# Altium schematic sheet Motor Interface - Connectors.SchDoc: Motor Interface - Connectors
size B; Organization: Midnight Sun Solar Rayce Car Team; Address1: University of Waterloo; Address2: 200 University Ave W; Address3: Waterloo, ON, Canada; Address4: N2L 3E9; DocumentNumber: 2; SheetNumber: 2; SheetTotal: 6; Website: www.uwmidsun.com
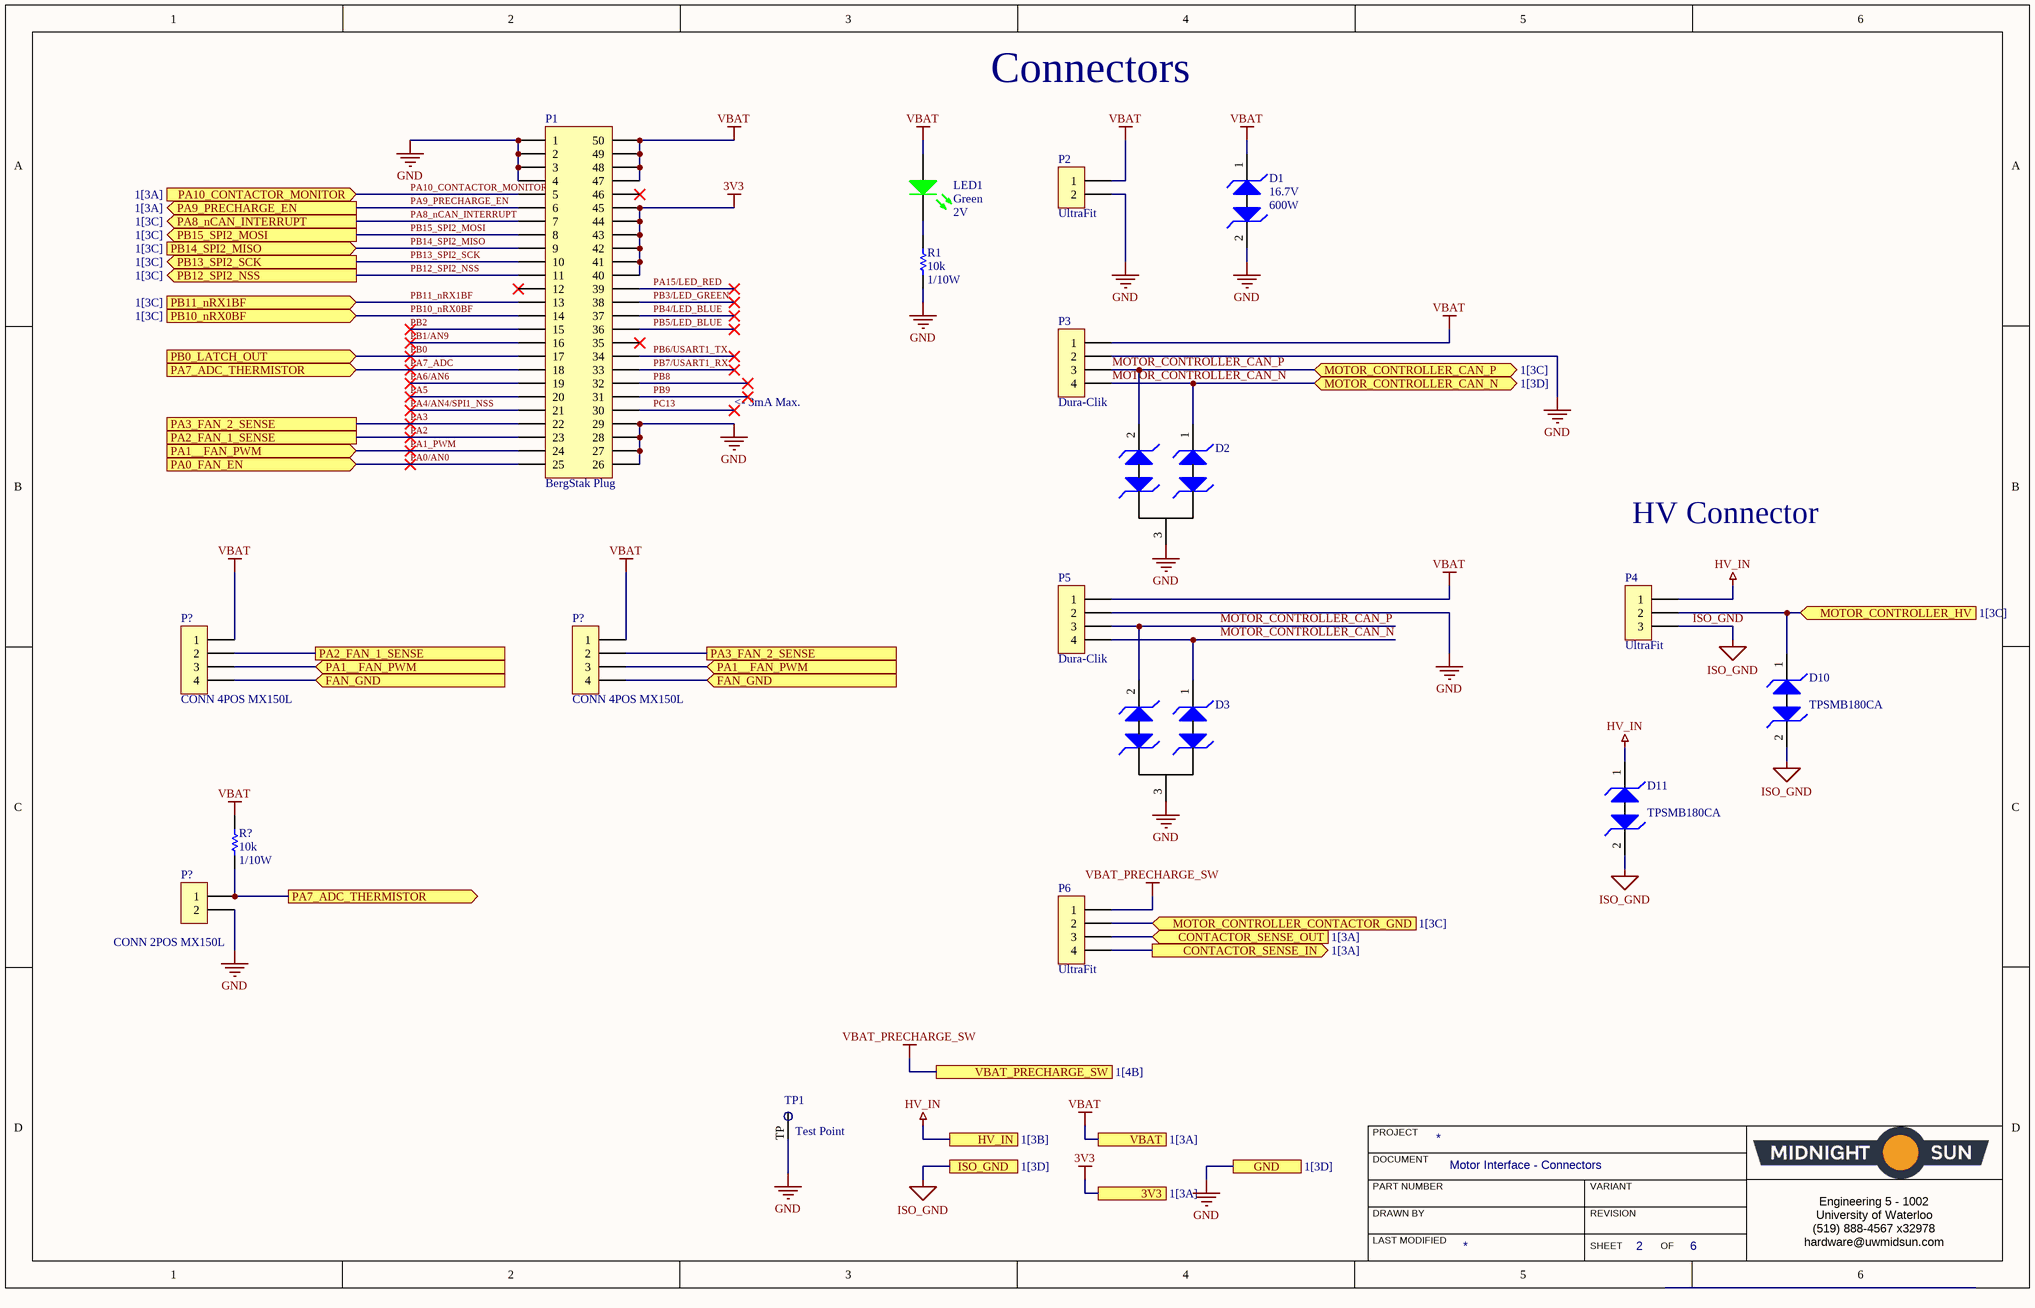
[diagram p0: Motor Interface - Connectors.SchDoc]

## Parts
(Parts that share a designator on the sheet are numbered #1, #2 ... from top to bottom, then left to right.)
D1  Voltage - Breakdown (Min): 16.7V  Power - Peak Pulse: 600W  [DO-214AA Diode]  (hidden comment: DIODE TVS 15VWM 24.4VC DO-214AA (SMB))
D2  DIODE TVS 24VWM 70VC SOT23  [MOSFET P-CH 30V 3.8A SOT-23]  (value not drawn)
D3  DIODE TVS 24VWM 70VC SOT23  [MOSFET P-CH 30V 3.8A SOT-23]  (value not drawn)
D10  Manufacturer Part Number: TPSMB180CA  [DIODE TVS TPSMB 600W DO-214AA SMB]  (hidden comment: TVS DIODE 154V 246V DO214AA)
D11  Manufacturer Part Number: TPSMB180CA  [DIODE TVS TPSMB 600W DO-214AA SMB]  (hidden comment: TVS DIODE 154V 246V DO214AA)
LED1  Color: Green  Voltage - Forward (Vf) (Typ): 2V  [LED_0603]  (hidden comment: LED GREEN CLEAR 2V 0603)
P1  Series: BergStak Plug  [CONN, Bergstak 50 Pos Plug]  (hidden comment: CONN 50POS Bergstak Plug 0.02")
P2  Series: UltraFit  [CONN, 2POS ULTRA-FIT]  (hidden comment: CONN 2POS ULTRA-FIT 0.138")
P3  Dura-Clik  [CONN, 4POS DURA-CLIK VERT]
P4  Series: UltraFit  [CONN, 3POS ULTRA-FIT]  (hidden comment: CONN 3POS ULTRA-FIT 0.138")
P5  Dura-Clik  [CONN, 4POS DURA-CLIK VERT]
P6  Series: UltraFit  [CONN, 4POS ULTRA-FIT]  (hidden comment: CONN 4POS ULTRA-FIT 0.138")
P?#1  CONN 4POS MX150L  [CONN, 4POS MX150L]
P?#2  CONN 4POS MX150L  [CONN, 4POS MX150L]
P?#3  CONN 2POS MX150L  [CONN, 2POS MX150L]
R1  Resistance: 10k  Power: 1/10W  [RES, 0603]  (hidden comment: RES 10K OHM 1% 1/10W 0603)
R?  Resistance: 10k  Power: 1/10W  [RES, 0603]  (hidden comment: RES 10K OHM 1% 1/10W 0603)
TP1  Test Point  [Test Point]

## Ports
3V3 (see 1[3A]), CONTACTOR_SENSE_IN (out, see 1[3A]), CONTACTOR_SENSE_OUT (in, see 1[3A]), FAN_GND (in), GND (see 1[3D]), HV_IN (see 1[3B]), ISO_GND (see 1[3D]), MOTOR_CONTROLLER_CAN_N (bidir, see 1[3D]), MOTOR_CONTROLLER_CAN_P (bidir, see 1[3C]), MOTOR_CONTROLLER_CONTACTOR_GND (in, see 1[3C]), MOTOR_CONTROLLER_HV (in, see 1[3C]), PA0_FAN_EN (in), PA1__FAN_PWM (in), PA2_FAN_1_SENSE, PA3_FAN_2_SENSE, PA7_ADC_THERMISTOR (in), PA7_ADC_THERMISTOR (out), PA8_nCAN_INTERRUPT (out, see 1[3C]), PA9_PRECHARGE_EN (out, see 1[3A]), PA10_CONTACTOR_MONITOR (in, see 1[3A]), PB0_LATCH_OUT (in), PB10_nRX0BF (in, see 1[3C]), PB11_nRX1BF (in, see 1[3C]), PB12_SPI2_NSS (out, see 1[3C]), PB13_SPI2_SCK (out, see 1[3C]), PB14_SPI2_MISO (in, see 1[3C]), PB15_SPI2_MOSI (out, see 1[3C]), VBAT (see 1[3A]), VBAT_PRECHARGE_SW (see 1[4B])

## Nets
3V3: P1.40 P1.41 P1.42 P1.43 P1.44 P1.45 ; port 3V3
GND: D1.2(Cathode2) D2.3(Common_Cathode) D3.3(Common_Cathode) P1.1 P1.2 P1.3 P1.4 P1.26 P1.27 P1.28 P1.29 P2.2 P3.2 P5.2 P?#3.2 R1.2 TP1.TP ; port GND
HV_IN: D11.1(Cathode1) P4.1 ; port HV_IN
ISO_GND: D10.2(Cathode2) D11.2(Cathode2) P4.3 ; port ISO_GND
VBAT: D1.1(Cathode1) LED1.1(A) P1.47 P1.48 P1.49 P1.50 P2.1 P3.1 P5.1 P?#1.1 P?#2.1 R?.1 ; port VBAT
VBAT_PRECHARGE_SW: P6.1 ; port VBAT_PRECHARGE_SW
CONTACTOR_SENSE_IN: P6.4 ; port CONTACTOR_SENSE_IN
CONTACTOR_SENSE_OUT: P6.3 ; port CONTACTOR_SENSE_OUT
FAN_GND: P?#1.4 P?#2.4 ; port FAN_GND
MOTOR_CONTROLLER_CAN_N: D2.1(Cathode1) D3.1(Cathode1) P3.4 P5.4 ; port MOTOR_CONTROLLER_CAN_N
MOTOR_CONTROLLER_CAN_P: D2.2(Cathode2) D3.2(Cathode2) P3.3 P5.3 ; port MOTOR_CONTROLLER_CAN_P
MOTOR_CONTROLLER_CONTACTOR_GND: P6.2 ; port MOTOR_CONTROLLER_CONTACTOR_GND
MOTOR_CONTROLLER_HV: D10.1(Cathode1) P4.2 ; port MOTOR_CONTROLLER_HV
PA0/AN0: P1.25 ; port PA0_FAN_EN
PA1_PWM: P1.24 P?#1.3 P?#2.3 ; port PA1__FAN_PWM
PA2: P1.23 P?#1.2 ; port PA2_FAN_1_SENSE
PA3: P1.22 P?#2.2 ; port PA3_FAN_2_SENSE
PA4/AN4/SPI1_NSS: P1.21
PA5: P1.20
PA6/AN6: P1.19
PA7_ADC: P1.18 P?#3.1 R?.2 ; port PA7_ADC_THERMISTOR
PA8_nCAN_INTERRUPT: P1.7 ; port PA8_nCAN_INTERRUPT
PA9_PRECHARGE_EN: P1.6 ; port PA9_PRECHARGE_EN
PA10_CONTACTOR_MONITOR: P1.5 ; port PA10_CONTACTOR_MONITOR
PA15/LED_RED: P1.39
PB0: P1.17 ; port PB0_LATCH_OUT
PB1/AN9: P1.16
PB2: P1.15
PB3/LED_GREEN: P1.38
PB4/LED_BLUE: P1.37
PB5/LED_BLUE: P1.36
PB6/USART1_TX: P1.34
PB7/USART1_RX: P1.33
PB8: P1.32
PB9: P1.31
PB10_nRX0BF: P1.14 ; port PB10_nRX0BF
PB11_nRX1BF: P1.13 ; port PB11_nRX1BF
PB12_SPI2_NSS: P1.11 ; port PB12_SPI2_NSS
PB13_SPI2_SCK: P1.10 ; port PB13_SPI2_SCK
PB14_SPI2_MISO: P1.9 ; port PB14_SPI2_MISO
PB15_SPI2_MOSI: P1.8 ; port PB15_SPI2_MOSI
PC13: P1.30
NetLED1_2: LED1.2(K) R1.1

Not connected (* = marked no-connect by the designer): P1 12* 35* 46*

## Notes on the sheet
- Connectors
- <- 3mA Max.
- HV Connector
- PROJECT
- DOCUMENT
- DRAWN BY
- LAST MODIFIED
- PART NUMBER
- REVISION
- SHEET
- VARIANT
- OF
- Engineering 5 - 1002
  University of Waterloo
  (519) 888-4567 x32978
  hardware@uwmidsun.com

## Library data of the parts
D1 = DIODE TVS 15VWM 24.4VC DO-214AA (SMB): TVS DIODE 15VWM 24.4VC SMB; Manufacturer 1: Fairchild/ON Semiconductor; Manufacturer Part Number 1: SMBJ15CA; Type: Zener; Voltage - Reverse Standoff (Typ): 15V; Voltage - Clamping (Max) @ Ipp: 24.4V; Current - Peak Pulse (10/1000µs): 24.6A; Power Line Protection: No; Supplier 1: Digi-Key; Supplier Part Number 1: SMBJ15CAFSCT-ND; RoHS: RoHS Compliant; Description 1: TVS DIODE 15VWM 24.4VC SMB; Category: Circuit Protection; Stock 1: 24965; Pricing 1: 1=0.54, 10=0.444, 100=0.3027, 500=0.22704, 1000=0.17028 (CAD); Packaging: Cut Tape (CT); Part Status: Active; Applications: General Purpose; Capacitance @ Frequency: -; Operating Temperature: -55°C ~ 150°C (TJ); Mounting Type: Surface Mount; Package / Case: DO-214AA, SMB; Supplier Device Package: DO-214AA (SMB); ComponentLink1URL: https://www.fairchildsemi.com/datasheets/SM/SMBJ10CA.pdf; ComponentLink1Description: https://www.fairchildsemi.com/datasheets/SM/SMBJ10CA.pdf
D2 D3 = DIODE TVS 24VWM 70VC SOT23: TVS DIODE 24VWM 70VC SOT23; Manufacturer 1: Nexperia USA Inc.; Manufacturer Part Number 1: PESD1CAN,215; Type: Zener; Voltage - Breakdown (Min): 25.4V; Voltage - Clamping (Max) @ Ipp: 70V; Current - Peak Pulse (10/1000µs): 3A (8/20µs); Power - Peak Pulse: 200W; Power Line Protection: No; Capacitance @ Frequency: 11pF @ 1MHz; Supplier 1: Digi-Key; Supplier Part Number 1: 1727-3817-1-ND; Packaging: Cut Tape (CT); Part Status: Active; Operating Temperature: -65°C ~ 150°C (TA); Mounting Type: Surface Mount; Package / Case: TO-236-3, SC-59, SOT-23-3; Supplier Device Package: SOT-23 (TO-236AB); ComponentLink1URL: http://assets.nexperia.com/documents/data-sheet/PESD1CAN.pdf; ComponentLink1Description: http://assets.nexperia.com/documents/data-sheet/PESD1CAN.pdf
D10 D11 = DIODE TVS 154V 246V DO-2144A (SMB): Manufacturer: Littelfuse; Supplier 1: Digi-Key; Stock 1: 2900; Pricing 1: 1=0.84, 10=0.734, 25=0.6504, 100=0.5664, 250=0.493, 500=0.41958, 1000=0.33566 (USD); Supplier Part Number 1: F10356CT-ND
LED1 = LED GREEN CLEAR 2V 0603: Green 572nm LED Indication - Discrete 2V 0603 (1608 Metric); Manufacturer: Wurth Electronics Inc.; Manufacturer Part Number: 150060VS75000; Lens Color: Colorless; Millicandela Rating: 40mcd; Lens Style/Size: Rectangle with Flat Top, 1.10mm x 0.70mm; Current - Test: 20mA; Viewing Angle: 140°; Wavelength - Dominant: 570nm; Supplier 1: Digi-Key; RoHS: RoHS Compliant; Category: Optoelectronics; Stock 1: 9408; Pricing 1: 1=0.21, 100=0.1617, 500=0.13964 (CAD); Packaging: Cut Tape (CT); Part Status: Active; Lens Transparency: Clear; Mounting Type: Surface Mount; Wavelength - Peak: 572nm; Features: -; Package / Case: 0603 (1608 Metric); Supplier Device Package: 0603; Size / Dimension: 1.60mm L x 0.80mm W; Height (Max): 0.80mm; ComponentLink1URL: http://katalog.we-online.de/led/datasheet/150060VS75000.pdf; ComponentLink1Description: http://katalog.we-online.de/led/datasheet/150060VS75000.pdf; Supplier Part Number 1: 732-4980-1-ND
P1 = CONN 50POS Bergstak Plug 0.02": 50 Position Connector Plug, Outer Shroud Contacts Surface Mount Gold; Manufacturer 1: Amphenol FCI; Manufacturer Part Number 1: 10132797-055100LF; Number of Positions: 50; Mated Stacking Heights: 5mm; Pitch: 0.020" (0.50mm); Supplier 1: Digi-Key; Supplier Part Number 1: 609-5226-1-ND; Packaging: Cut Tape (CT); Part Status: Active; Connector Type: Plug, Outer Shroud Contacts; Number of Rows: 2; Mounting Type: Surface Mount; Contact Finish: Gold; Contact Finish Thickness: 1µin (0.025µm); Height Above Board: 0.169" (4.30mm); ComponentLink1URL: http://portal.fciconnect.com/Comergent//fci/drawing/10132797.pdf; ComponentLink1Description: http://portal.fciconnect.com/Comergent//fci/drawing/10132797.pdf
P2 = CONN 2POS ULTRA-FIT 0.138": 2 Positions Header, Shrouded Connector 0.138" (3.50mm) Through Hole Gold; Manufacturer 1: Molex, LLC; Manufacturer Part Number 1: 1722861302; Style: Board to Board or Cable; Shrouding: Shrouded - 4 Wall; Number of Positions: 2; Number of Positions Loaded: All; Contact Length - Post: 0.126" (3.20mm); Material Flammability Rating: UL94 V-0; Mated Stacking Heights: 26.99mm; Voltage: 400V; Supplier 1: Digi-Key; Supplier Part Number 1: WM11673-ND; Packaging: Tray; Part Status: Active; Connector Type: Header; Contact Type: Male Pin; Pitch - Mating: 0.138" (3.50mm); Number of Rows: 1; Row Spacing - Mating: -; Mounting Type: Through Hole; Termination: Kinked Pin, Solder; Fastening Type: Latch Holder; Contact Length - Mating: -; Overall Contact Length: -; Insulation Height: 0.465" (11.80mm); Contact Shape: Square; Contact Finish - Mating: Gold; Contact Finish Thickness - Mating: 30µin (0.76µm); Contact Finish - Post: Tin; Contact Material: Copper Alloy; Insulation Material: Liquid Crystal Polymer (LCP); Operating Temperature: -40°C ~ 120°C; Ingress Protection: -; Insulation Color: Black; Current Rating: -; Contact Finish Thickness - Post: 60µin (1.52µm); ComponentLink1URL: http://www.molex.com/pdm_docs/sd/1722861302_sd.pdf; ComponentLink1Description: http://www.molex.com/pdm_docs/sd/1722861302_sd.pdf
P3 P5 = CONN 4POS DURA-CLIK 0.079": 4 Positions Header Connector 0.079" (2.00mm) Surface Mount Tin; Manufacturer: Molex, LLC; Manufacturer Part Number: 5600200420; Style: Board to Cable/Wire; Shrouding: Shrouded - 4 Wall; Number of Positions: 4; Number of Positions Loaded: All; Mated Stacking Heights: 9.3mm; Supplier 1: Digi-Key; RoHS: RoHS Compliant; Category: Connectors, Interconnects; Stock 1: 9367; Pricing 1: 1=2.23, 10=2.022, 25=1.898, 50=1.8156, 100=1.733 (CAD); Packaging: Cut Tape (CT); Part Status: Active; Connector Type: Header; Contact Type: Male Pin; Pitch - Mating: 0.079" (2.00mm); Number of Rows: 1; Row Spacing - Mating: -; Mounting Type: Surface Mount; Termination: Solder; Fastening Type: Latch Lock; Contact Length - Mating: -; Contact Length - Post: -; Overall Contact Length: -; Insulation Height: 0.315" (8.00mm); Contact Shape: Square; Contact Finish - Mating: Tin; Contact Finish Thickness - Mating: -; Contact Finish - Post: Tin; Contact Material: Copper Alloy; Insulation Material: Polyamide (PA), Nylon; Features: Solder Retention; Operating Temperature: -; Ingress Protection: -; Material Flammability Rating: -; Insulation Color: Natural; Current Rating: -; Voltage Rating: -; Contact Finish Thickness - Post: -; Applications: Automotive, Industrial; ComponentLink1URL: http://www.molex.com/pdm_docs/sd/5600200420_sd.pdf; ComponentLink1Description: http://www.molex.com/pdm_docs/sd/5600200420_sd.pdf; Supplier Part Number 1: WM10864CT-ND
P4 = CONN 3POS ULTRA-FIT 0.138": 3 Positions Header Connector 0.138" (3.50mm) Through Hole Tin; Manufacturer 1: Molex, LLC; Manufacturer Part Number 1: 1722871103; Style: Board to Cable/Wire; Shrouding: Shrouded - 4 Wall; Number of Positions: 3; Number of Positions Loaded: All; Contact Length - Post: 0.126" (3.20mm); Material Flammability Rating: UL94 V-0; Mated Stacking Heights: 26.99mm; Voltage: 400V; Supplier 1: Digi-Key; Supplier Part Number 1: WM11702-ND; Packaging: Tray; Part Status: Active; Connector Type: Header; Contact Type: Male Pin; Pitch - Mating: 0.138" (3.50mm); Number of Rows: 1; Row Spacing - Mating: -; Mounting Type: Through Hole; Termination: Solder; Fastening Type: Latch Holder; Contact Length - Mating: -; Overall Contact Length: -; Insulation Height: 0.465" (11.80mm); Contact Shape: Square; Contact Finish - Mating: Tin; Contact Finish Thickness - Mating: 60µin (1.52µm); Contact Finish - Post: Tin; Contact Material: Copper Alloy; Insulation Material: Liquid Crystal Polymer (LCP); Operating Temperature: -40°C ~ 105°C; Ingress Protection: -; Insulation Color: Black; Current Rating: -; Contact Finish Thickness - Post: 60µin (1.52µm); ComponentLink1URL: http://www.molex.com/pdm_docs/sd/1722871103_sd.pdf; ComponentLink1Description: http://www.molex.com/pdm_docs/sd/1722871103_sd.pdf
P6 = CONN 4POS ULTRA-FIT 0.138": 4 Positions Header Connector 0.138" (3.50mm) Through Hole Tin; Manufacturer 1: Molex, LLC; Manufacturer Part Number 1: 1722871104; Style: Board to Cable/Wire; Shrouding: Shrouded - 4 Wall; Number of Positions: 4; Number of Positions Loaded: All; Contact Length - Post: 0.126" (3.20mm); Material Flammability Rating: UL94 V-0; Mated Stacking Heights: 26.99mm; Voltage: 400V; Supplier 1: Digi-Key; Supplier Part Number 1: WM11703-ND; Packaging: Tray; Part Status: Active; Connector Type: Header; Contact Type: Male Pin; Pitch - Mating: 0.138" (3.50mm); Number of Rows: 1; Row Spacing - Mating: -; Mounting Type: Through Hole; Termination: Solder; Fastening Type: Latch Holder; Contact Length - Mating: -; Overall Contact Length: -; Insulation Height: 0.465" (11.80mm); Contact Shape: Square; Contact Finish - Mating: Tin; Contact Finish Thickness - Mating: 60µin (1.52µm); Contact Finish - Post: Tin; Contact Material: Copper Alloy; Insulation Material: Liquid Crystal Polymer (LCP); Operating Temperature: -40°C ~ 105°C; Ingress Protection: -; Insulation Color: Black; Current Rating: -; Contact Finish Thickness - Post: 60µin (1.52µm); ComponentLink1URL: http://www.molex.com/pdm_docs/sd/1722871104_sd.pdf; ComponentLink1Description: http://www.molex.com/pdm_docs/sd/1722871104_sd.pdf
P?#1 P?#2 = CONN 4POS MX150L: Connector Header Panel Mount, Through Hole, Right Angle 4 position 0.230" (5.84mm)
P?#3 = CONN 2POS MX150L: Connector Header Panel Mount, Through Hole, Right Angle 2 position 0.230" (5.84mm); Manufacturer: Molex, LLC; Manufacturer Part Number: 0194270109; Number of Positions: 2; Number of Positions Loaded: All; Style: Board to Cable/Wire; Shrouding: Shrouded - 4 Wall; Contact Length - Post: 0.134" (3.40mm); Material Flammability Rating: UL94 V-0; Supplier 1: Digi-Key; RoHS: RoHS Compliant; Category: Connectors, Interconnects; Stock 1: 0; Pricing 1: 1040=3.59614 (CAD); Packaging: Tray; Part Status: Active; Connector Type: Header; Contact Type: Male Pin; Pitch - Mating: 0.230" (5.84mm); Number of Rows: 1; Row Spacing - Mating: -; Mounting Type: Panel Mount, Through Hole, Right Angle; Termination: Solder; Fastening Type: Locking Ramp; Contact Length - Mating: -; Overall Contact Length: -; Insulation Height: 1.147" (29.13mm); Contact Shape: Square; Contact Finish - Mating: Gold; Contact Finish Thickness - Mating: 30.0µin (0.76µm); Contact Finish - Post: Tin; Contact Material: Copper Alloy; Insulation Material: Polybutylene Terephthalate (PBT), Glass Filled; Features: Board Guide; Operating Temperature: -; Ingress Protection: -; Insulation Color: Black; Current Rating: -; Voltage Rating: -; Mated Stacking Heights: -; Contact Finish Thickness - Post: 100.0µin (2.54µm); Applications: Automotive, General Purpose, Industrial; ComponentLink1URL: https://www.molex.com/pdm_docs/sd/194270109_sd.pdf; ComponentLink1Description: https://www.molex.com/pdm_docs/sd/194270109_sd.pdf; Supplier Part Number 1: 0194270109-ND
R1 R? = RES 10K OHM 1% 1/10W 0603: RES SMD 10K OHM 1% 1/10W 0603; Manufacturer 1: Yageo; Manufacturer Part Number 1: RC0603FR-0710KL; Temperature Coefficient: ±100ppm/°C; Supplier 1: Digi-Key; Supplier Part Number 1: 311-10.0KHRCT-ND; Packaging: Cut Tape (CT); Part Status: Active; Composition: Thick Film; Operating Temperature: -55°C ~ 155°C; Package / Case: 0603 (1608 Metric); Supplier Device Package: 0603; Size / Dimension: 0.063" L x 0.031" W (1.60mm x 0.80mm); Height - Seated (Max): 0.022" (0.55mm); Failure Rate: -; ComponentLink1URL: http://www.yageo.com/documents/recent/PYu-RC_Group_51_RoHS_L_7.pdf; ComponentLink1Description: http://www.yageo.com/documents/recent/PYu-RC_Group_51_RoHS_L_7.pdf; Tolerance: ±1%